# Altium schematic sheet C-06 CPU IO_PHY.SchDoc
size 513 x 386 mm; Address1: 350W 9th Ave; Address2: Suite 206; Address3: Escondido CA 92025; Address4: United States; Revision: -; ENG_APP_DATE: --/--/--; DSN_APP_DATE: --/--/--; CHK_APP_DATE: --/--/--
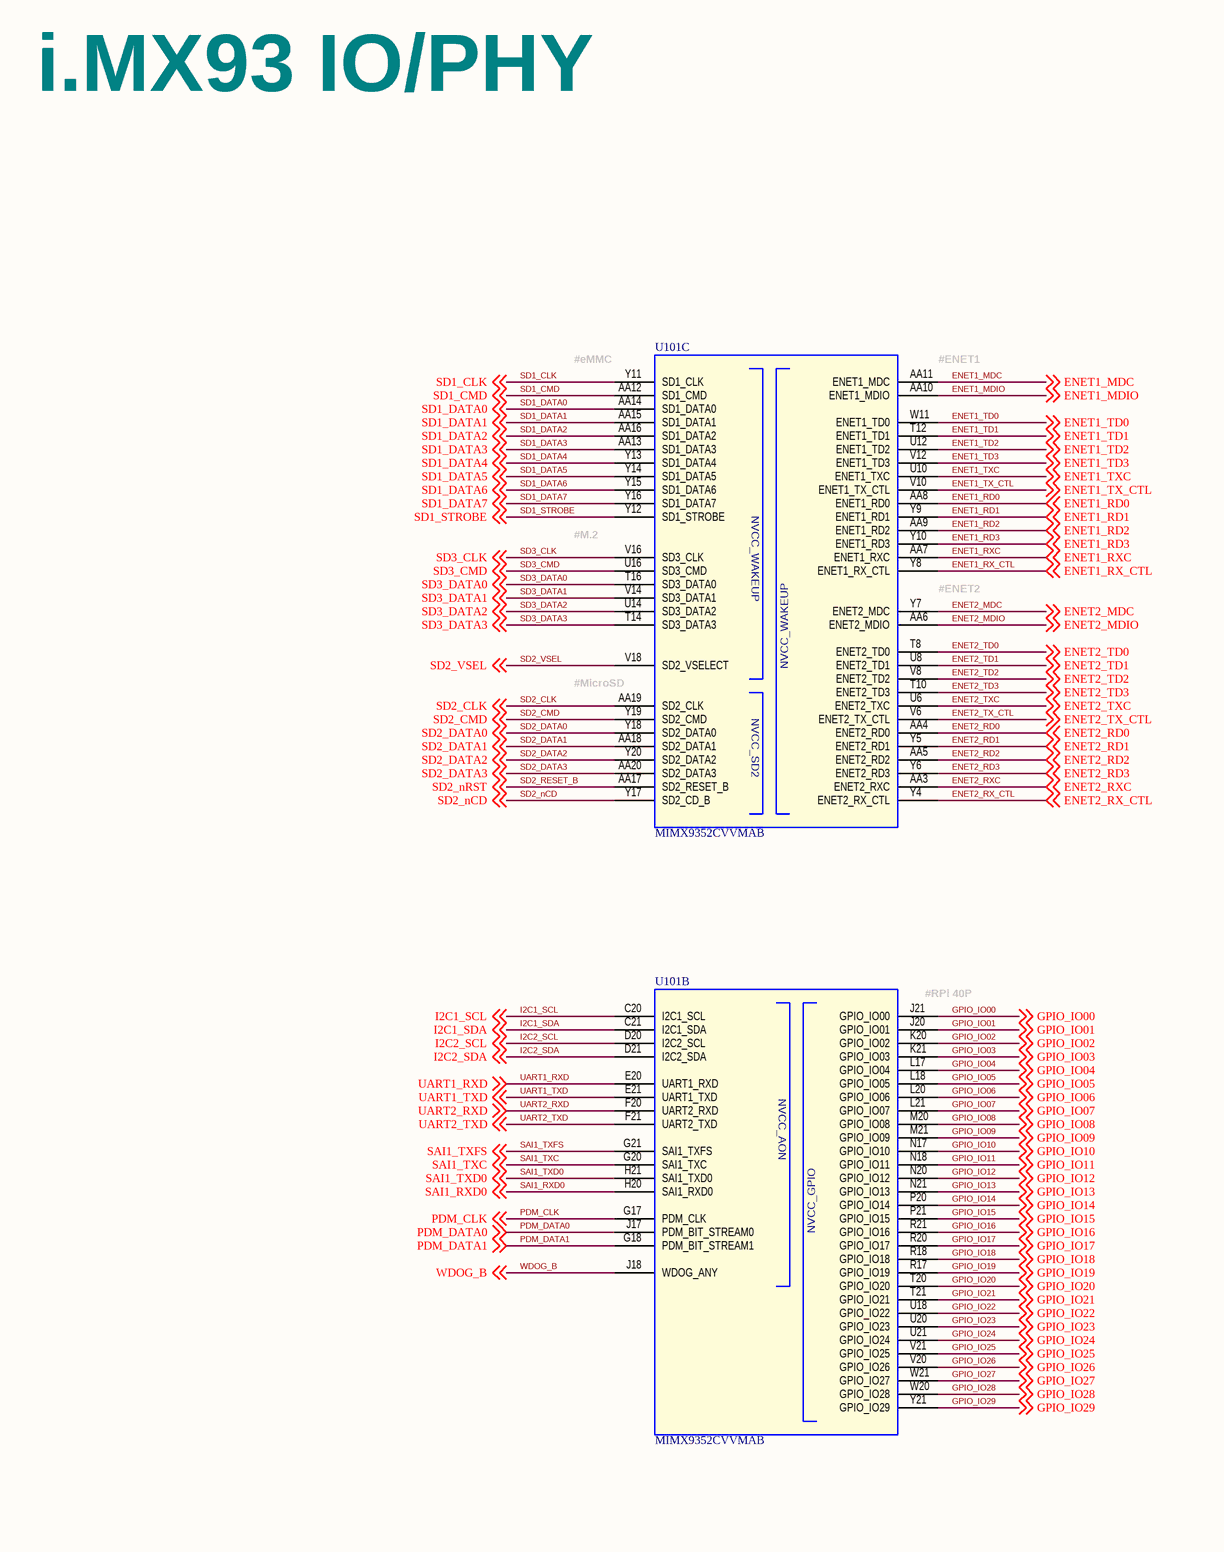
[diagram p0: C-06 CPU IO_PHY.SchDoc, left]
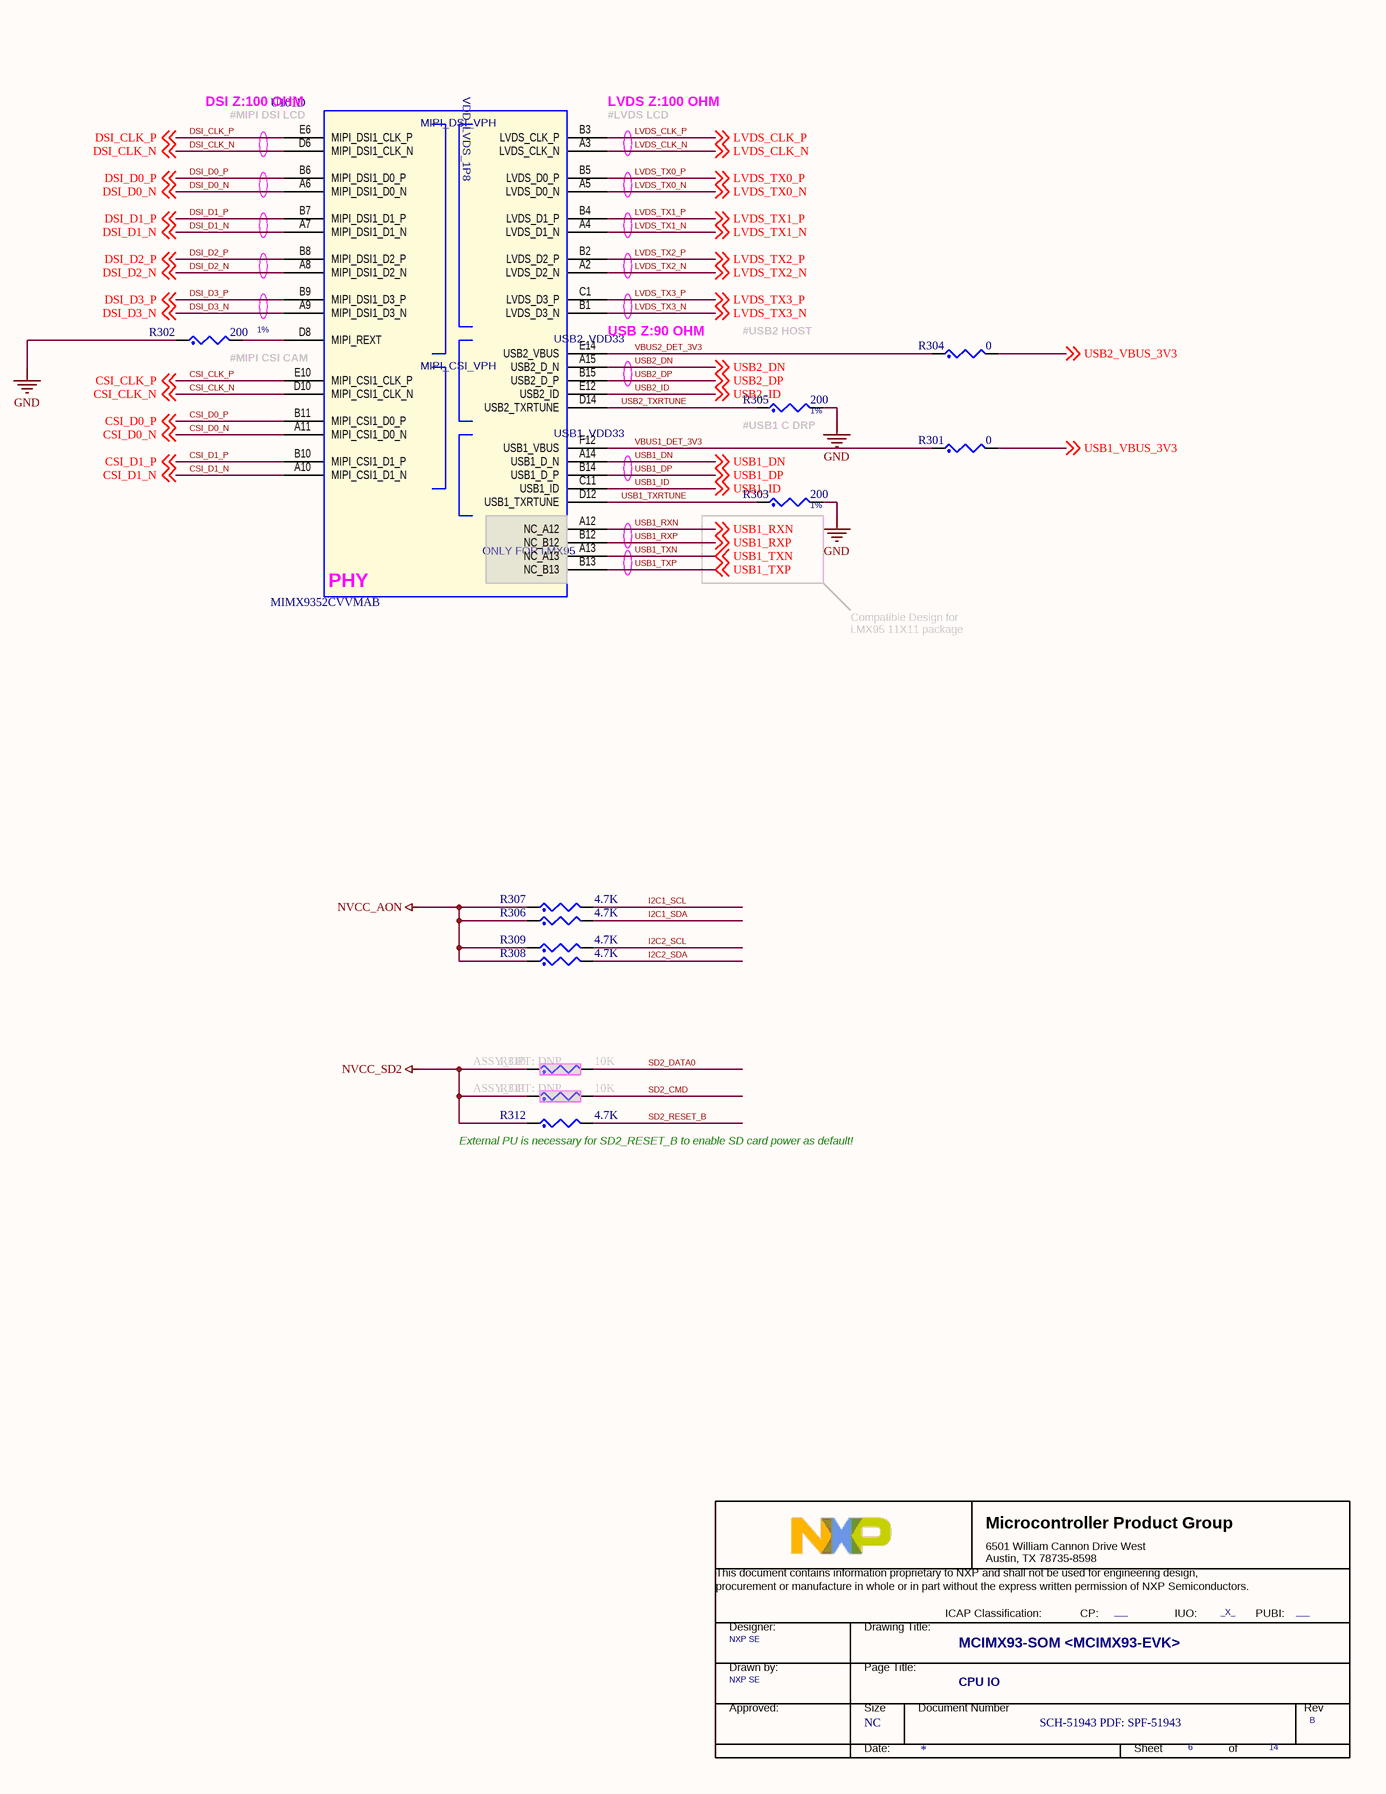
[diagram p1: C-06 CPU IO_PHY.SchDoc, right]

## Parts
*  Doc: SCH-51943 PDF: SPF-51943  RevCode: B  Title: MCIMX93-SOM <MCIMX93-EVK>  Page Size: NC  Page Number: 6  Page Count: 14  PageTitle: CPU IO  Designer: NXP SE  PUBI: ___  FIUO: _X_  (hidden comment: TitleBlock_MCPG)  (graphical)
R301  0  [0201_CC]
R302  200  Tolerance: 1%  [0201_CC]
R303  200  Tolerance: 1%  [0201_CC]
R304  0  [0201_CC]
R305  200  Tolerance: 1%  [0201_CC]
R306  4.7K  [0402_CC]
R307  4.7K  [0402_CC]
R308  4.7K  [0402_CC]
R309  4.7K  [0402_CC]
R310  10K  ASSY_OPT: DNP  [0402_CC]
R311  10K  ASSY_OPT: DNP  [0402_CC]
R312  4.7K  [0402_CC]
U101  MIMX9352CVVMAB  [SKT_BGA306_0P5_SQ16P23_ELAST]  (parts B,C,D of 6)

## Nets
GND: R302.1 R303.2 R305.2
NVCC_AON: R306.1 R307.1 R308.1 R309.1
NVCC_SD2: R310.1 R311.1 R312.1
CSI_CLK_N: U101.D10(MIPI_CSI1_CLK_N) ; off-sheet CSI_CLK_N
CSI_CLK_P: U101.E10(MIPI_CSI1_CLK_P) ; off-sheet CSI_CLK_P
CSI_D0_N: U101.A11(MIPI_CSI1_D0_N) ; off-sheet CSI_D0_N
CSI_D0_P: U101.B11(MIPI_CSI1_D0_P) ; off-sheet CSI_D0_P
CSI_D1_N: U101.A10(MIPI_CSI1_D1_N) ; off-sheet CSI_D1_N
CSI_D1_P: U101.B10(MIPI_CSI1_D1_P) ; off-sheet CSI_D1_P
DSI_CLK_N: U101.D6(MIPI_DSI1_CLK_N) ; off-sheet DSI_CLK_N
DSI_CLK_P: U101.E6(MIPI_DSI1_CLK_P) ; off-sheet DSI_CLK_P
DSI_D0_N: U101.A6(MIPI_DSI1_D0_N) ; off-sheet DSI_D0_N
DSI_D0_P: U101.B6(MIPI_DSI1_D0_P) ; off-sheet DSI_D0_P
DSI_D1_N: U101.A7(MIPI_DSI1_D1_N) ; off-sheet DSI_D1_N
DSI_D1_P: U101.B7(MIPI_DSI1_D1_P) ; off-sheet DSI_D1_P
DSI_D2_N: U101.A8(MIPI_DSI1_D2_N) ; off-sheet DSI_D2_N
DSI_D2_P: U101.B8(MIPI_DSI1_D2_P) ; off-sheet DSI_D2_P
DSI_D3_N: U101.A9(MIPI_DSI1_D3_N) ; off-sheet DSI_D3_N
DSI_D3_P: U101.B9(MIPI_DSI1_D3_P) ; off-sheet DSI_D3_P
ENET1_MDC: U101.AA11(ENET1_MDC) ; off-sheet ENET1_MDC
ENET1_MDIO: U101.AA10(ENET1_MDIO) ; off-sheet ENET1_MDIO
ENET1_RD0: U101.AA8(ENET1_RD0) ; off-sheet ENET1_RD0
ENET1_RD1: U101.Y9(ENET1_RD1) ; off-sheet ENET1_RD1
ENET1_RD2: U101.AA9(ENET1_RD2) ; off-sheet ENET1_RD2
ENET1_RD3: U101.Y10(ENET1_RD3) ; off-sheet ENET1_RD3
ENET1_RX_CTL: U101.Y8(ENET1_RX_CTL) ; off-sheet ENET1_RX_CTL
ENET1_RXC: U101.AA7(ENET1_RXC) ; off-sheet ENET1_RXC
ENET1_TD0: U101.W11(ENET1_TD0) ; off-sheet ENET1_TD0
ENET1_TD1: U101.T12(ENET1_TD1) ; off-sheet ENET1_TD1
ENET1_TD2: U101.U12(ENET1_TD2) ; off-sheet ENET1_TD2
ENET1_TD3: U101.V12(ENET1_TD3) ; off-sheet ENET1_TD3
ENET1_TX_CTL: U101.V10(ENET1_TX_CTL) ; off-sheet ENET1_TX_CTL
ENET1_TXC: U101.U10(ENET1_TXC) ; off-sheet ENET1_TXC
ENET2_MDC: U101.Y7(ENET2_MDC) ; off-sheet ENET2_MDC
ENET2_MDIO: U101.AA6(ENET2_MDIO) ; off-sheet ENET2_MDIO
ENET2_RD0: U101.AA4(ENET2_RD0) ; off-sheet ENET2_RD0
ENET2_RD1: U101.Y5(ENET2_RD1) ; off-sheet ENET2_RD1
ENET2_RD2: U101.AA5(ENET2_RD2) ; off-sheet ENET2_RD2
ENET2_RD3: U101.Y6(ENET2_RD3) ; off-sheet ENET2_RD3
ENET2_RX_CTL: U101.Y4(ENET2_RX_CTL) ; off-sheet ENET2_RX_CTL
ENET2_RXC: U101.AA3(ENET2_RXC) ; off-sheet ENET2_RXC
ENET2_TD0: U101.T8(ENET2_TD0) ; off-sheet ENET2_TD0
ENET2_TD1: U101.U8(ENET2_TD1) ; off-sheet ENET2_TD1
ENET2_TD2: U101.V8(ENET2_TD2) ; off-sheet ENET2_TD2
ENET2_TD3: U101.T10(ENET2_TD3) ; off-sheet ENET2_TD3
ENET2_TX_CTL: U101.V6(ENET2_TX_CTL) ; off-sheet ENET2_TX_CTL
ENET2_TXC: U101.U6(ENET2_TXC) ; off-sheet ENET2_TXC
GPIO_IO00: U101.J21(GPIO_IO00) ; off-sheet GPIO_IO00
GPIO_IO01: U101.J20(GPIO_IO01) ; off-sheet GPIO_IO01
GPIO_IO02: U101.K20(GPIO_IO02) ; off-sheet GPIO_IO02
GPIO_IO03: U101.K21(GPIO_IO03) ; off-sheet GPIO_IO03
GPIO_IO04: U101.L17(GPIO_IO04) ; off-sheet GPIO_IO04
GPIO_IO05: U101.L18(GPIO_IO05) ; off-sheet GPIO_IO05
GPIO_IO06: U101.L20(GPIO_IO06) ; off-sheet GPIO_IO06
GPIO_IO07: U101.L21(GPIO_IO07) ; off-sheet GPIO_IO07
GPIO_IO08: U101.M20(GPIO_IO08) ; off-sheet GPIO_IO08
GPIO_IO09: U101.M21(GPIO_IO09) ; off-sheet GPIO_IO09
GPIO_IO10: U101.N17(GPIO_IO10) ; off-sheet GPIO_IO10
GPIO_IO11: U101.N18(GPIO_IO11) ; off-sheet GPIO_IO11
GPIO_IO12: U101.N20(GPIO_IO12) ; off-sheet GPIO_IO12
GPIO_IO13: U101.N21(GPIO_IO13) ; off-sheet GPIO_IO13
GPIO_IO14: U101.P20(GPIO_IO14) ; off-sheet GPIO_IO14
GPIO_IO15: U101.P21(GPIO_IO15) ; off-sheet GPIO_IO15
GPIO_IO16: U101.R21(GPIO_IO16) ; off-sheet GPIO_IO16
GPIO_IO17: U101.R20(GPIO_IO17) ; off-sheet GPIO_IO17
GPIO_IO18: U101.R18(GPIO_IO18) ; off-sheet GPIO_IO18
GPIO_IO19: U101.R17(GPIO_IO19) ; off-sheet GPIO_IO19
GPIO_IO20: U101.T20(GPIO_IO20) ; off-sheet GPIO_IO20
GPIO_IO21: U101.T21(GPIO_IO21) ; off-sheet GPIO_IO21
GPIO_IO22: U101.U18(GPIO_IO22) ; off-sheet GPIO_IO22
GPIO_IO23: U101.U20(GPIO_IO23) ; off-sheet GPIO_IO23
GPIO_IO24: U101.U21(GPIO_IO24) ; off-sheet GPIO_IO24
GPIO_IO25: U101.V21(GPIO_IO25) ; off-sheet GPIO_IO25
GPIO_IO26: U101.V20(GPIO_IO26) ; off-sheet GPIO_IO26
GPIO_IO27: U101.W21(GPIO_IO27) ; off-sheet GPIO_IO27
GPIO_IO28: U101.W20(GPIO_IO28) ; off-sheet GPIO_IO28
GPIO_IO29: U101.Y21(GPIO_IO29) ; off-sheet GPIO_IO29
I2C1_SCL: R307.2 U101.C20(I2C1_SCL) ; off-sheet I2C1_SCL
I2C1_SDA: R306.2 U101.C21(I2C1_SDA) ; off-sheet I2C1_SDA
I2C2_SCL: R309.2 U101.D20(I2C2_SCL) ; off-sheet I2C2_SCL
I2C2_SDA: R308.2 U101.D21(I2C2_SDA) ; off-sheet I2C2_SDA
LVDS_CLK_N: U101.A3(LVDS_CLK_N) ; off-sheet LVDS_CLK_N
LVDS_CLK_P: U101.B3(LVDS_CLK_P) ; off-sheet LVDS_CLK_P
LVDS_TX0_N: U101.A5(LVDS_D0_N) ; off-sheet LVDS_TX0_N
LVDS_TX0_P: U101.B5(LVDS_D0_P) ; off-sheet LVDS_TX0_P
LVDS_TX1_N: U101.A4(LVDS_D1_N) ; off-sheet LVDS_TX1_N
LVDS_TX1_P: U101.B4(LVDS_D1_P) ; off-sheet LVDS_TX1_P
LVDS_TX2_N: U101.A2(LVDS_D2_N) ; off-sheet LVDS_TX2_N
LVDS_TX2_P: U101.B2(LVDS_D2_P) ; off-sheet LVDS_TX2_P
LVDS_TX3_N: U101.B1(LVDS_D3_N) ; off-sheet LVDS_TX3_N
LVDS_TX3_P: U101.C1(LVDS_D3_P) ; off-sheet LVDS_TX3_P
PDM_CLK: U101.G17(PDM_CLK) ; off-sheet PDM_CLK
PDM_DATA0: U101.J17(PDM_BIT_STREAM0) ; off-sheet PDM_DATA0
PDM_DATA1: U101.G18(PDM_BIT_STREAM1) ; off-sheet PDM_DATA1
SAI1_RXD0: U101.H20(SAI1_RXD0) ; off-sheet SAI1_RXD0
SAI1_TXC: U101.G20(SAI1_TXC) ; off-sheet SAI1_TXC
SAI1_TXD0: U101.H21(SAI1_TXD0) ; off-sheet SAI1_TXD0
SAI1_TXFS: U101.G21(SAI1_TXFS) ; off-sheet SAI1_TXFS
SD1_CLK: U101.Y11(SD1_CLK) ; off-sheet SD1_CLK
SD1_CMD: U101.AA12(SD1_CMD) ; off-sheet SD1_CMD
SD1_DATA0: U101.AA14(SD1_DATA0) ; off-sheet SD1_DATA0
SD1_DATA1: U101.AA15(SD1_DATA1) ; off-sheet SD1_DATA1
SD1_DATA2: U101.AA16(SD1_DATA2) ; off-sheet SD1_DATA2
SD1_DATA3: U101.AA13(SD1_DATA3) ; off-sheet SD1_DATA3
SD1_DATA4: U101.Y13(SD1_DATA4) ; off-sheet SD1_DATA4
SD1_DATA5: U101.Y14(SD1_DATA5) ; off-sheet SD1_DATA5
SD1_DATA6: U101.Y15(SD1_DATA6) ; off-sheet SD1_DATA6
SD1_DATA7: U101.Y16(SD1_DATA7) ; off-sheet SD1_DATA7
SD1_STROBE: U101.Y12(SD1_STROBE) ; off-sheet SD1_STROBE
SD2_CLK: U101.AA19(SD2_CLK) ; off-sheet SD2_CLK
SD2_CMD: R311.2 U101.Y19(SD2_CMD) ; off-sheet SD2_CMD
SD2_DATA0: R310.2 U101.Y18(SD2_DATA0) ; off-sheet SD2_DATA0
SD2_DATA1: U101.AA18(SD2_DATA1) ; off-sheet SD2_DATA1
SD2_DATA2: U101.Y20(SD2_DATA2) ; off-sheet SD2_DATA2
SD2_DATA3: U101.AA20(SD2_DATA3) ; off-sheet SD2_DATA3
SD2_nCD: U101.Y17(SD2_CD_B) ; off-sheet SD2_nCD
SD2_RESET_B: R312.2 U101.AA17(SD2_RESET_B) ; off-sheet SD2_nRST  [also labelled SD2_nRST]
SD2_VSEL: U101.V18(SD2_VSELECT) ; off-sheet SD2_VSEL
SD3_CLK: U101.V16(SD3_CLK) ; off-sheet SD3_CLK
SD3_CMD: U101.U16(SD3_CMD) ; off-sheet SD3_CMD
SD3_DATA0: U101.T16(SD3_DATA0) ; off-sheet SD3_DATA0
SD3_DATA1: U101.V14(SD3_DATA1) ; off-sheet SD3_DATA1
SD3_DATA2: U101.U14(SD3_DATA2) ; off-sheet SD3_DATA2
SD3_DATA3: U101.T14(SD3_DATA3) ; off-sheet SD3_DATA3
UART1_RXD: U101.E20(UART1_RXD) ; off-sheet UART1_RXD
UART1_TXD: U101.E21(UART1_TXD) ; off-sheet UART1_TXD
UART2_RXD: U101.F20(UART2_RXD) ; off-sheet UART2_RXD
UART2_TXD: U101.F21(UART2_TXD) ; off-sheet UART2_TXD
USB1_DN: U101.A14(USB1_D_N) ; off-sheet USB1_DN
USB1_DP: U101.B14(USB1_D_P) ; off-sheet USB1_DP
USB1_ID: U101.C11(USB1_ID) ; off-sheet USB1_ID
USB1_RXN: U101.A12(NC_A12) ; off-sheet USB1_RXN
USB1_RXP: U101.B12(NC_B12) ; off-sheet USB1_RXP
USB1_TXN: U101.A13(NC_A13) ; off-sheet USB1_TXN
USB1_TXP: U101.B13(NC_B13) ; off-sheet USB1_TXP
USB1_TXRTUNE: R303.1 U101.D12(USB1_TXRTUNE)
USB1_VBUS_3V3: R301.2 ; off-sheet USB1_VBUS_3V3
USB2_DN: U101.A15(USB2_D_N) ; off-sheet USB2_DN
USB2_DP: U101.B15(USB2_D_P) ; off-sheet USB2_DP
USB2_ID: U101.E12(USB2_ID) ; off-sheet USB2_ID
USB2_TXRTUNE: R305.1 U101.D14(USB2_TXRTUNE)
USB2_VBUS_3V3: R304.2 ; off-sheet USB2_VBUS_3V3
VBUS1_DET_3V3: R301.1 U101.F12(USB1_VBUS)
VBUS2_DET_3V3: R304.1 U101.E14(USB2_VBUS)
WDOG_B: U101.J18(WDOG_ANY) ; off-sheet WDOG_B
NetR302_2: R302.2 U101.D8(MIPI_REXT)

## Notes on the sheet
- i.MX93 IO/PHY
- (near U101) DSI Z:100 OHM
- (near U101) LVDS Z:100 OHM
- #eMMC
- (near U101) #ENET1
- (near U101) #MIPI DSI LCD
- (near U101) #LVDS LCD
- #M.2
- (near U101) #ENET2
- #MIPI CSI CAM
- (near U101) USB Z:90 OHM
- #USB2 HOST
- (near U101) #MicroSD
- (near R305) #USB1 C DRP
- (near U101) PHY
- Compatible Design for
  i.MX95 11X11 package
- (near U101) #RPi 40P
- (near R312) External PU is necessary for SD2_RESET_B to enable SD card power as default!
- 8
- 7
- 6
- 5
- 4
- 3
- 2
- 1
- REVISION
- DESCRIPTION
- DATE
- APPROVED
- F
- E
- D
- C
- B
- PROJECT:
- REV.
- ENG:
- APPROVALS
- PROJECT
- JordanDSP LLC <https://www.jordandsp.com>
- Envision Excellence
- SHT.
- A
- DSN:
- CHK:
- REFERENCE ITEMS
- PRJ VCS REVISION:
- TITLE
- DOC VCS REVISION:
- MODIFIED DATE:
- BOM:
- FAB DWG:
- FIRMWARE:
- ASSY DWG:
- SCALE:
- SIZE
- CAGE CODE
- FILE NAME
- DWG NO.
- PAGE
- PRODUCT REV
- OF
- (in symbol MIMX9352DVNxLAA, part B) NVCC_GPIO
- (in symbol MIMX9352DVNxLAA, part C) NVCC_WAKEUP
- (in symbol MIMX9352DVNxLAA, part D) MIPI_DSI_VPH; USB2_VDD33; MIPI_CSI_VPH; USB1_VDD33; ONLY FOR i.MX95
- (in symbol TitleBlock_MCPG) Microcontroller Product Group; 6501 William Cannon Drive West / Austin, TX 78735-8598; This document contains information proprietary to NXP and shall not be used for engineering design,; procurement or manufacture in whole or in part without the express written permission of NXP Semiconductors.; ICAP Classification:; CP:; IUO:; PUBI:; Designer:; Drawing Title:; Drawn by:; Page Title:; Approved:; Size; Document Number; Rev; Date:; Sheet; of

## Library data of the parts
* = TitleBlock_MCPG: OrgName: NXP Semiconductor; OrgAddr1: NO. 192 Liangjing Rd. Pudong New Area, ShangHai; Page Create Date: March  8, 1995; DrawnBy: NXP SE; FCP: ___; Page Modify Date: *
R301 = RES: RES MF ZERO OHM 1/20W -- 0201; CLASS: DISCRETE; FPLIST: RC0201,0201_CC,RC0201_X2; CAD_APPROVED: Yes; MFG_PN01: CR0201-J/-000GLF; MFG_NAME01: BOURNS; AGILE_PN: 470-76631; PCB Footprint: 0201_CC; HEIGHT: 0.30 MM; ROHS: Yes
R302 = RES: RES MF 200 OHM 1/20W 1% 0201; CLASS: DISCRETE; Temp Range: -55¡ãC ~ 125¡ãC; VOLTAGE: 25V; AGILE_PN: 470-82323; MFG_NAME01: YAGEO AMERICA; MFG_PN01: RC0201FR-07200RL; CAD_APPROVED: Yes; FPLIST: RC0201,0201_CC; PCB Footprint: 0201_CC; ROHS: Yes; Temp_Range: -55¡ãC ~ 125¡ãC; HEIGHT: 0.26MM
R303 R305 = RES: RES MF 200 OHM 1/20W 1% 0201; CLASS: DISCRETE; FPLIST: RC0201,0201_CC; CAD_APPROVED: Yes; Temp_Range: -55¡ãC ~ 125¡ãC; MFG_PN01: RC0201FR-07200RL; MFG_NAME01: YAGEO AMERICA; AGILE_PN: 470-82323; VOLTAGE: 25V; PCB Footprint: 0201_CC; HEIGHT: 0.26MM; ROHS: Yes; Temp Range: -55¡ãC ~ 125¡ãC
R304 = RES: RES MF ZERO OHM 1/20W -- 0201; CLASS: DISCRETE; AGILE_PN: 470-76631; MFG_NAME01: BOURNS; MFG_PN01: CR0201-J/-000GLF; CAD_APPROVED: Yes; FPLIST: RC0201,0201_CC,RC0201_X2; PCB Footprint: 0201_CC; ROHS: Yes; HEIGHT: 0.30 MM
R306 = RES: RES MF 4.7K 1/10W 5% AEC-Q200 0402; CLASS: DISCRETE; VOLTAGE: 50V; AGILE_PN: 470-82064; MFG_NAME01: KOA SPEER; MFG_PN01: RK73B1ETTP472J; Temp_Range: -55C to +155C; CAD_APPROVED: Yes; FPLIST: RC0402_25,RC0402_HD,0402_CC,RC0402_X2; PCB Footprint: 0402_CC; Tolerance: 5%; ROHS: Yes; HEIGHT: 0.41mm; Temp Range: -55C to +155C
R307 = RES: RES MF 4.7K 1/10W 5% AEC-Q200 0402; CLASS: DISCRETE; Temp Range: -55C to +155C; FPLIST: RC0402_25,RC0402_HD,0402_CC,RC0402_X2; CAD_APPROVED: Yes; MFG_PN01: RK73B1ETTP472J; MFG_NAME01: KOA SPEER; AGILE_PN: 470-82064; VOLTAGE: 50V; PCB Footprint: 0402_CC; HEIGHT: 0.41mm; Temp_Range: -55C to +155C; ROHS: Yes; Tolerance: 5%
R308 R309 R312 = RES: RES MF 4.7K 1/10W 5% AEC-Q200 0402; CLASS: DISCRETE; Temp Range: -55C to +155C; AGILE_PN: 470-82064; MFG_NAME01: KOA SPEER; MFG_PN01: RK73B1ETTP472J; CAD_APPROVED: Yes; FPLIST: RC0402_25,RC0402_HD,0402_CC,RC0402_X2; VOLTAGE: 50V; PCB Footprint: 0402_CC; Tolerance: 5%; ROHS: Yes; Temp_Range: -55C to +155C; HEIGHT: 0.41mm
R310 = RES: RES MF 10K 1/16W 5% 0402; CLASS: DISCRETE; FPLIST: RC0402_25,RC0402_HD,0402_CC; CAD_APPROVED: Yes; MFG_PN01: CRCW040210K0JNED; MFG_NAME01: VISHAY INTERTECHNOLOGY; AGILE_PN: 470-75557; PCB Footprint: 0402_CC; HEIGHT: 0.4 MM; ROHS: Yes; Tolerance: 5%
R311 = RES: RES MF 10K 1/16W 5% 0402; CLASS: DISCRETE; AGILE_PN: 470-75557; MFG_NAME01: VISHAY INTERTECHNOLOGY; MFG_PN01: CRCW040210K0JNED; CAD_APPROVED: Yes; FPLIST: RC0402_25,RC0402_HD,0402_CC; PCB Footprint: 0402_CC; Tolerance: 5%; ROHS: Yes; HEIGHT: 0.4 MM
U101 = MIMX9352DVNxLAA: SUBASSEMBLY SKT 306 BGA ELASTOMER SMT 0.5MM 395H AU + IC CPU 1.7GHz -- FCBGA306; PCB Footprint: skt_bga306_0p5_sq16p23_elast_nsp; AGILE_PN: 750-78710; FPLIST: skt_bga306_0p5_sq16p23_elast,skt_bga306_0p5_sq16p23_elast_nsp; CAD_APPROVED: Yes; MFG_PN01: 211-81728,330-77207; CLASS: IC; HEIGHT: 10.03MM; ROHS: Yes; MFG_NAME01: SUBASSEMBLY; Manufacturer Part Number: MIMX9352CVVMAB